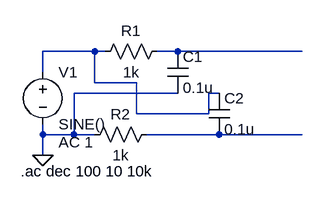
[diagram p0: schematic (2)b.asc]
(2)b.asc, the LTspice schematic file:
Version 4
SHEET 1 880 680
WIRE 96 64 16 64
WIRE 112 64 96 64
WIRE 224 64 192 64
WIRE 416 64 224 64
WIRE 16 96 16 64
WIRE 96 112 96 64
WIRE 160 112 96 112
WIRE 224 128 64 128
WIRE 288 128 272 128
WIRE 160 160 160 112
WIRE 272 160 272 128
WIRE 272 160 160 160
WIRE 16 192 16 176
WIRE 64 192 64 128
WIRE 64 192 16 192
WIRE 96 192 64 192
WIRE 288 192 176 192
WIRE 416 192 288 192
WIRE 16 224 16 192
FLAG 16 224 0
SYMBOL voltage 16 80 R0
WINDOW 123 24 124 Left 2
WINDOW 39 0 0 Left 2
SYMATTR InstName V1
SYMATTR Value SINE()
SYMATTR Value2 AC 1
SYMBOL res 208 48 R90
WINDOW 0 0 56 VBottom 2
WINDOW 3 32 56 VTop 2
SYMATTR InstName R1
SYMATTR Value 1k
SYMBOL res 192 176 R90
WINDOW 0 0 56 VBottom 2
WINDOW 3 32 56 VTop 2
SYMATTR InstName R2
SYMATTR Value 1k
SYMBOL cap 208 64 R0
SYMATTR InstName C1
SYMATTR Value 0.1u
SYMBOL cap 272 128 R0
SYMATTR InstName C2
SYMATTR Value 0.1u
TEXT -18 248 Left 2 !.ac dec 100 10 10k

The netlist it stands for:
* (2)b.asc
V1 N001 0 SINE() AC 1
R1 N002 N001 1k
R2 N003 0 1k
C1 N002 0 0.1u
C2 N001 N003 0.1u
.ac dec 100 10 10k
.backanno
.end